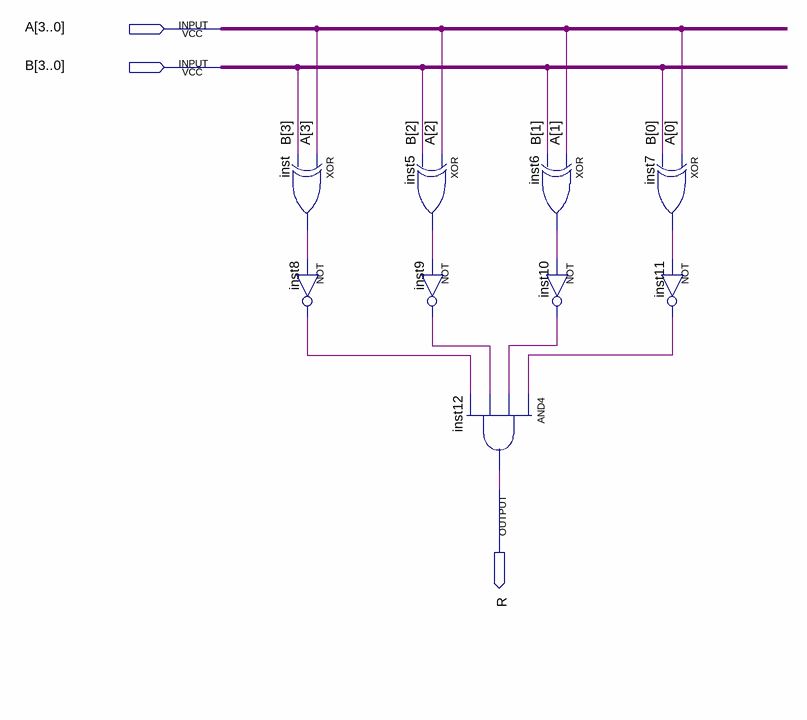
[diagram p0: schematic sheet]
// Quartus schematic igual.bdf as structural Verilog: 9 symbols, 3 pins
module igual (
  input  [3:0] A,
  input  [3:0] B,
  output R
);

  wire inst5_out, inst6_out, inst7_out, inst8_out, inst9_out, inst10_out, inst11_out, inst_out;

  xor inst (inst_out, A[3], B[3]);
  not inst8 (inst8_out, inst_out);
  xor inst5 (inst5_out, A[2], B[2]);
  not inst9 (inst9_out, inst5_out);
  and inst12 (R, inst11_out, inst10_out, inst9_out, inst8_out);
  xor inst6 (inst6_out, A[1], B[1]);
  not inst10 (inst10_out, inst6_out);
  xor inst7 (inst7_out, A[0], B[0]);
  not inst11 (inst11_out, inst7_out);
endmodule
